# Altium schematic sheet Copy of testboard_chip1_bk.SchDoc
size E
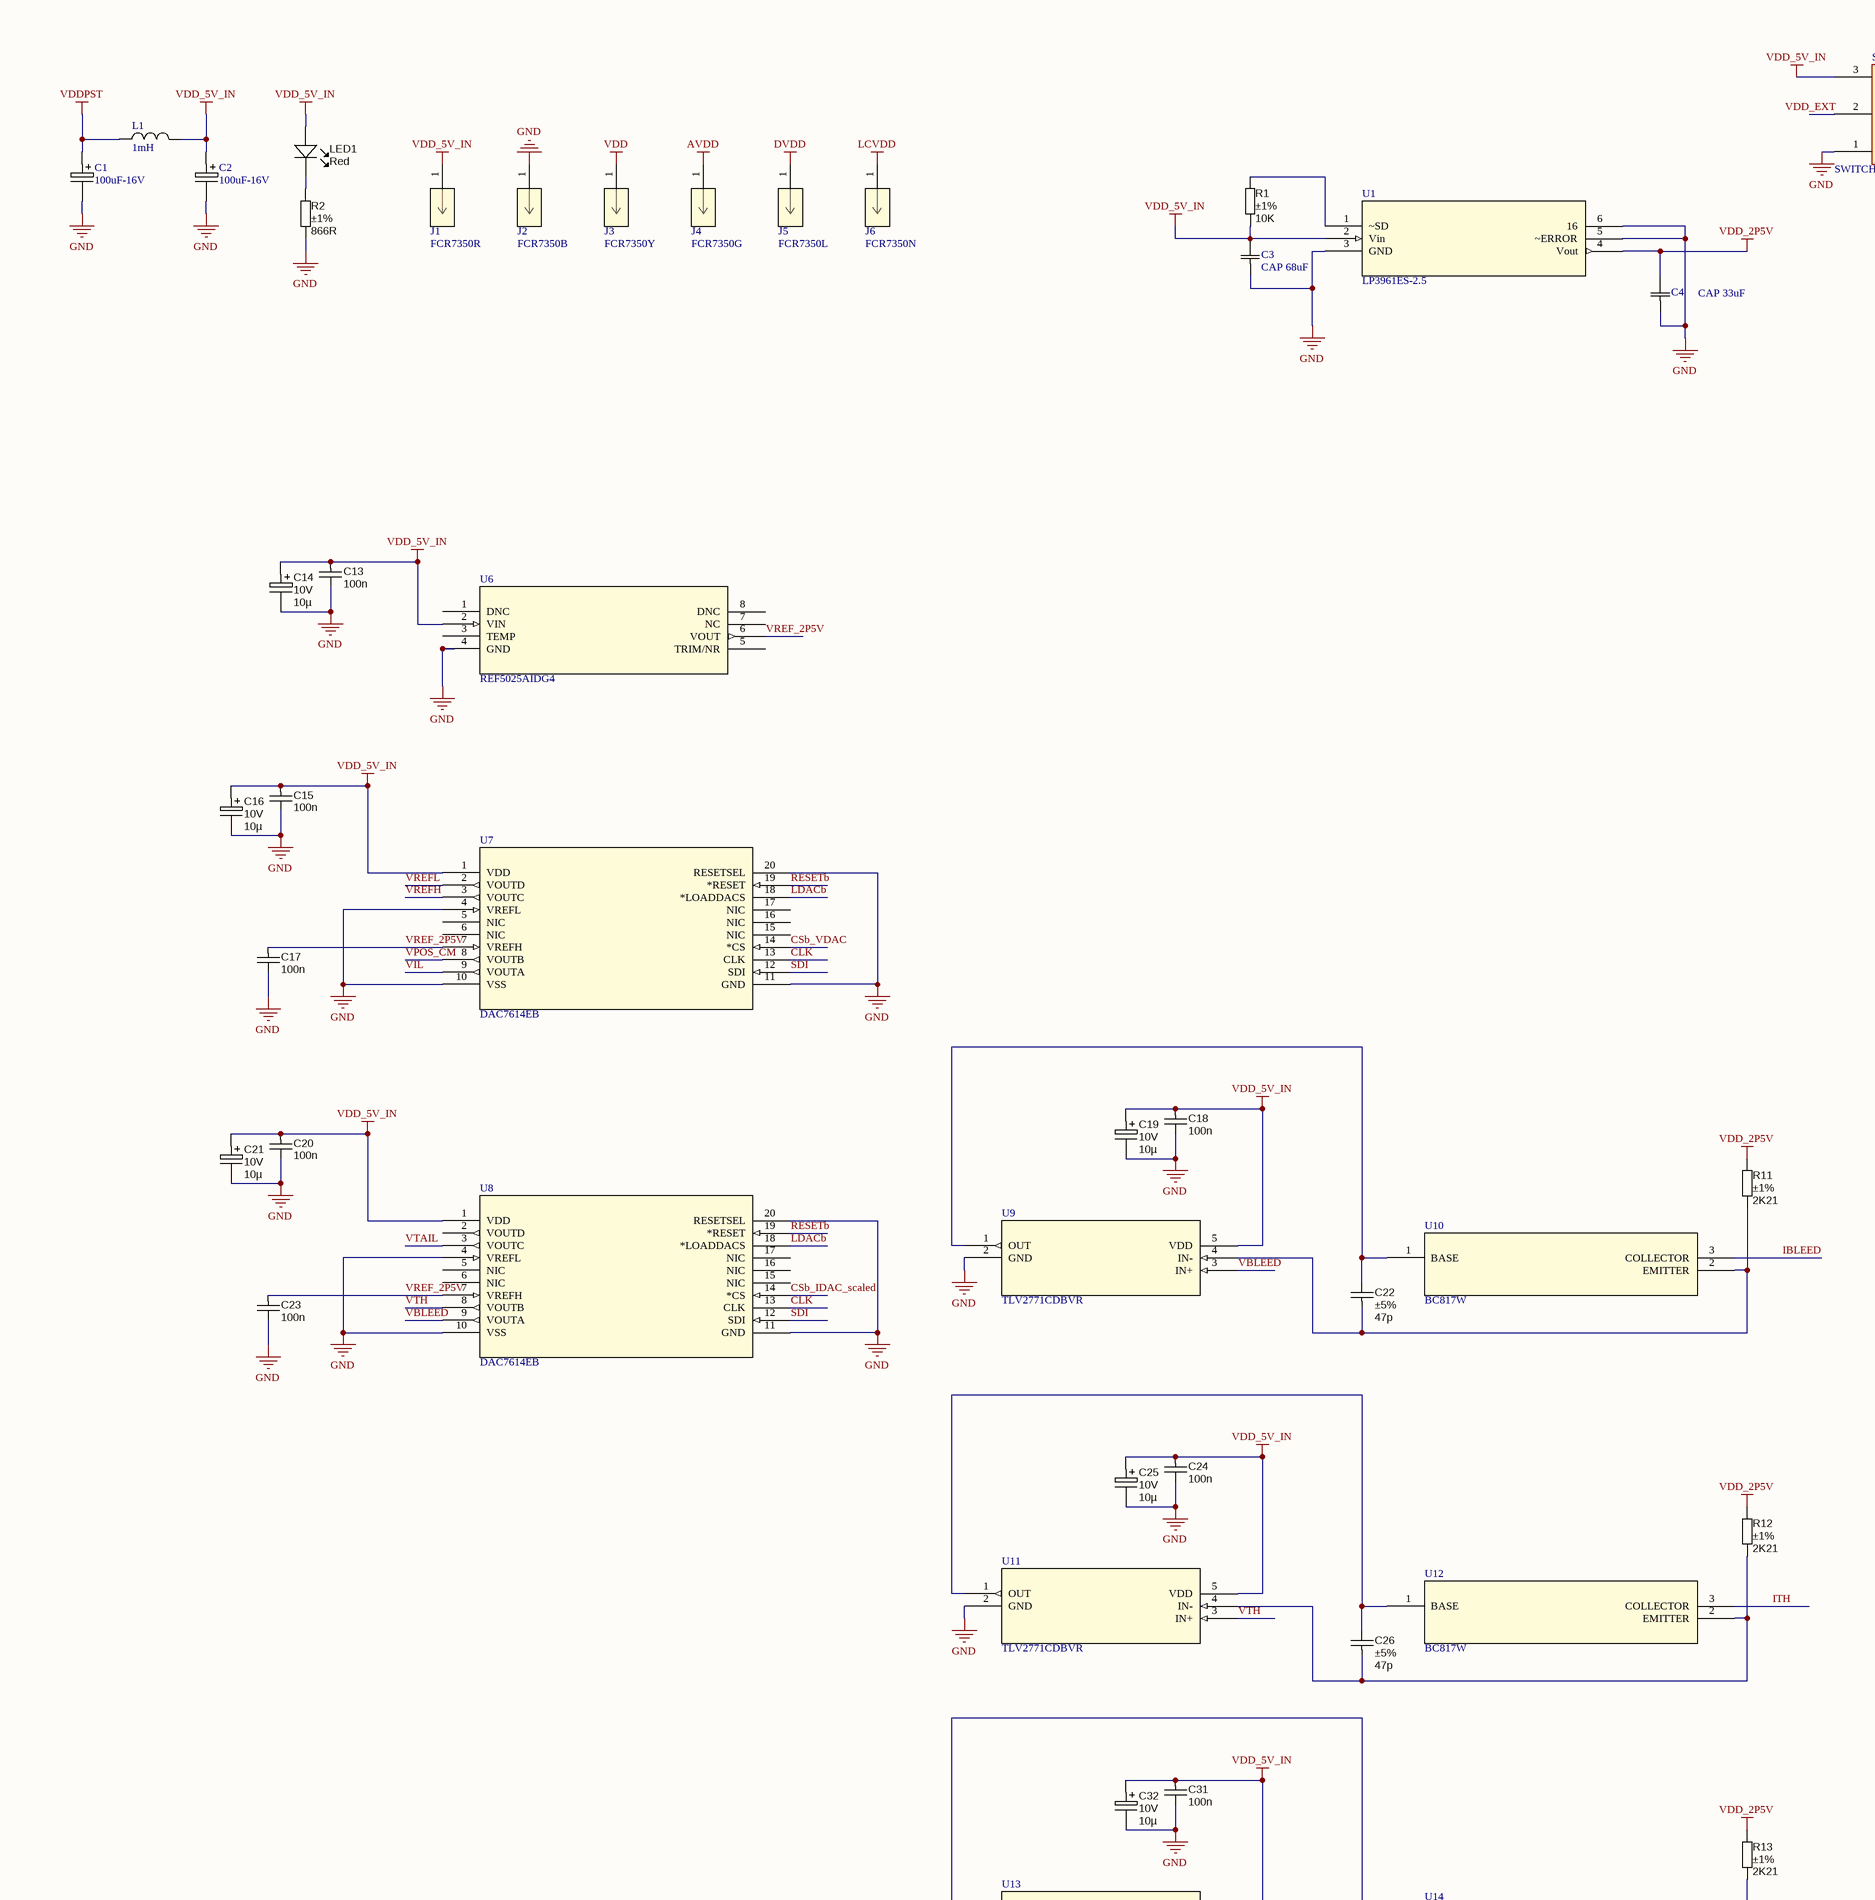
[diagram p0: Copy of testboard_chip1_bk.SchDoc, top left]
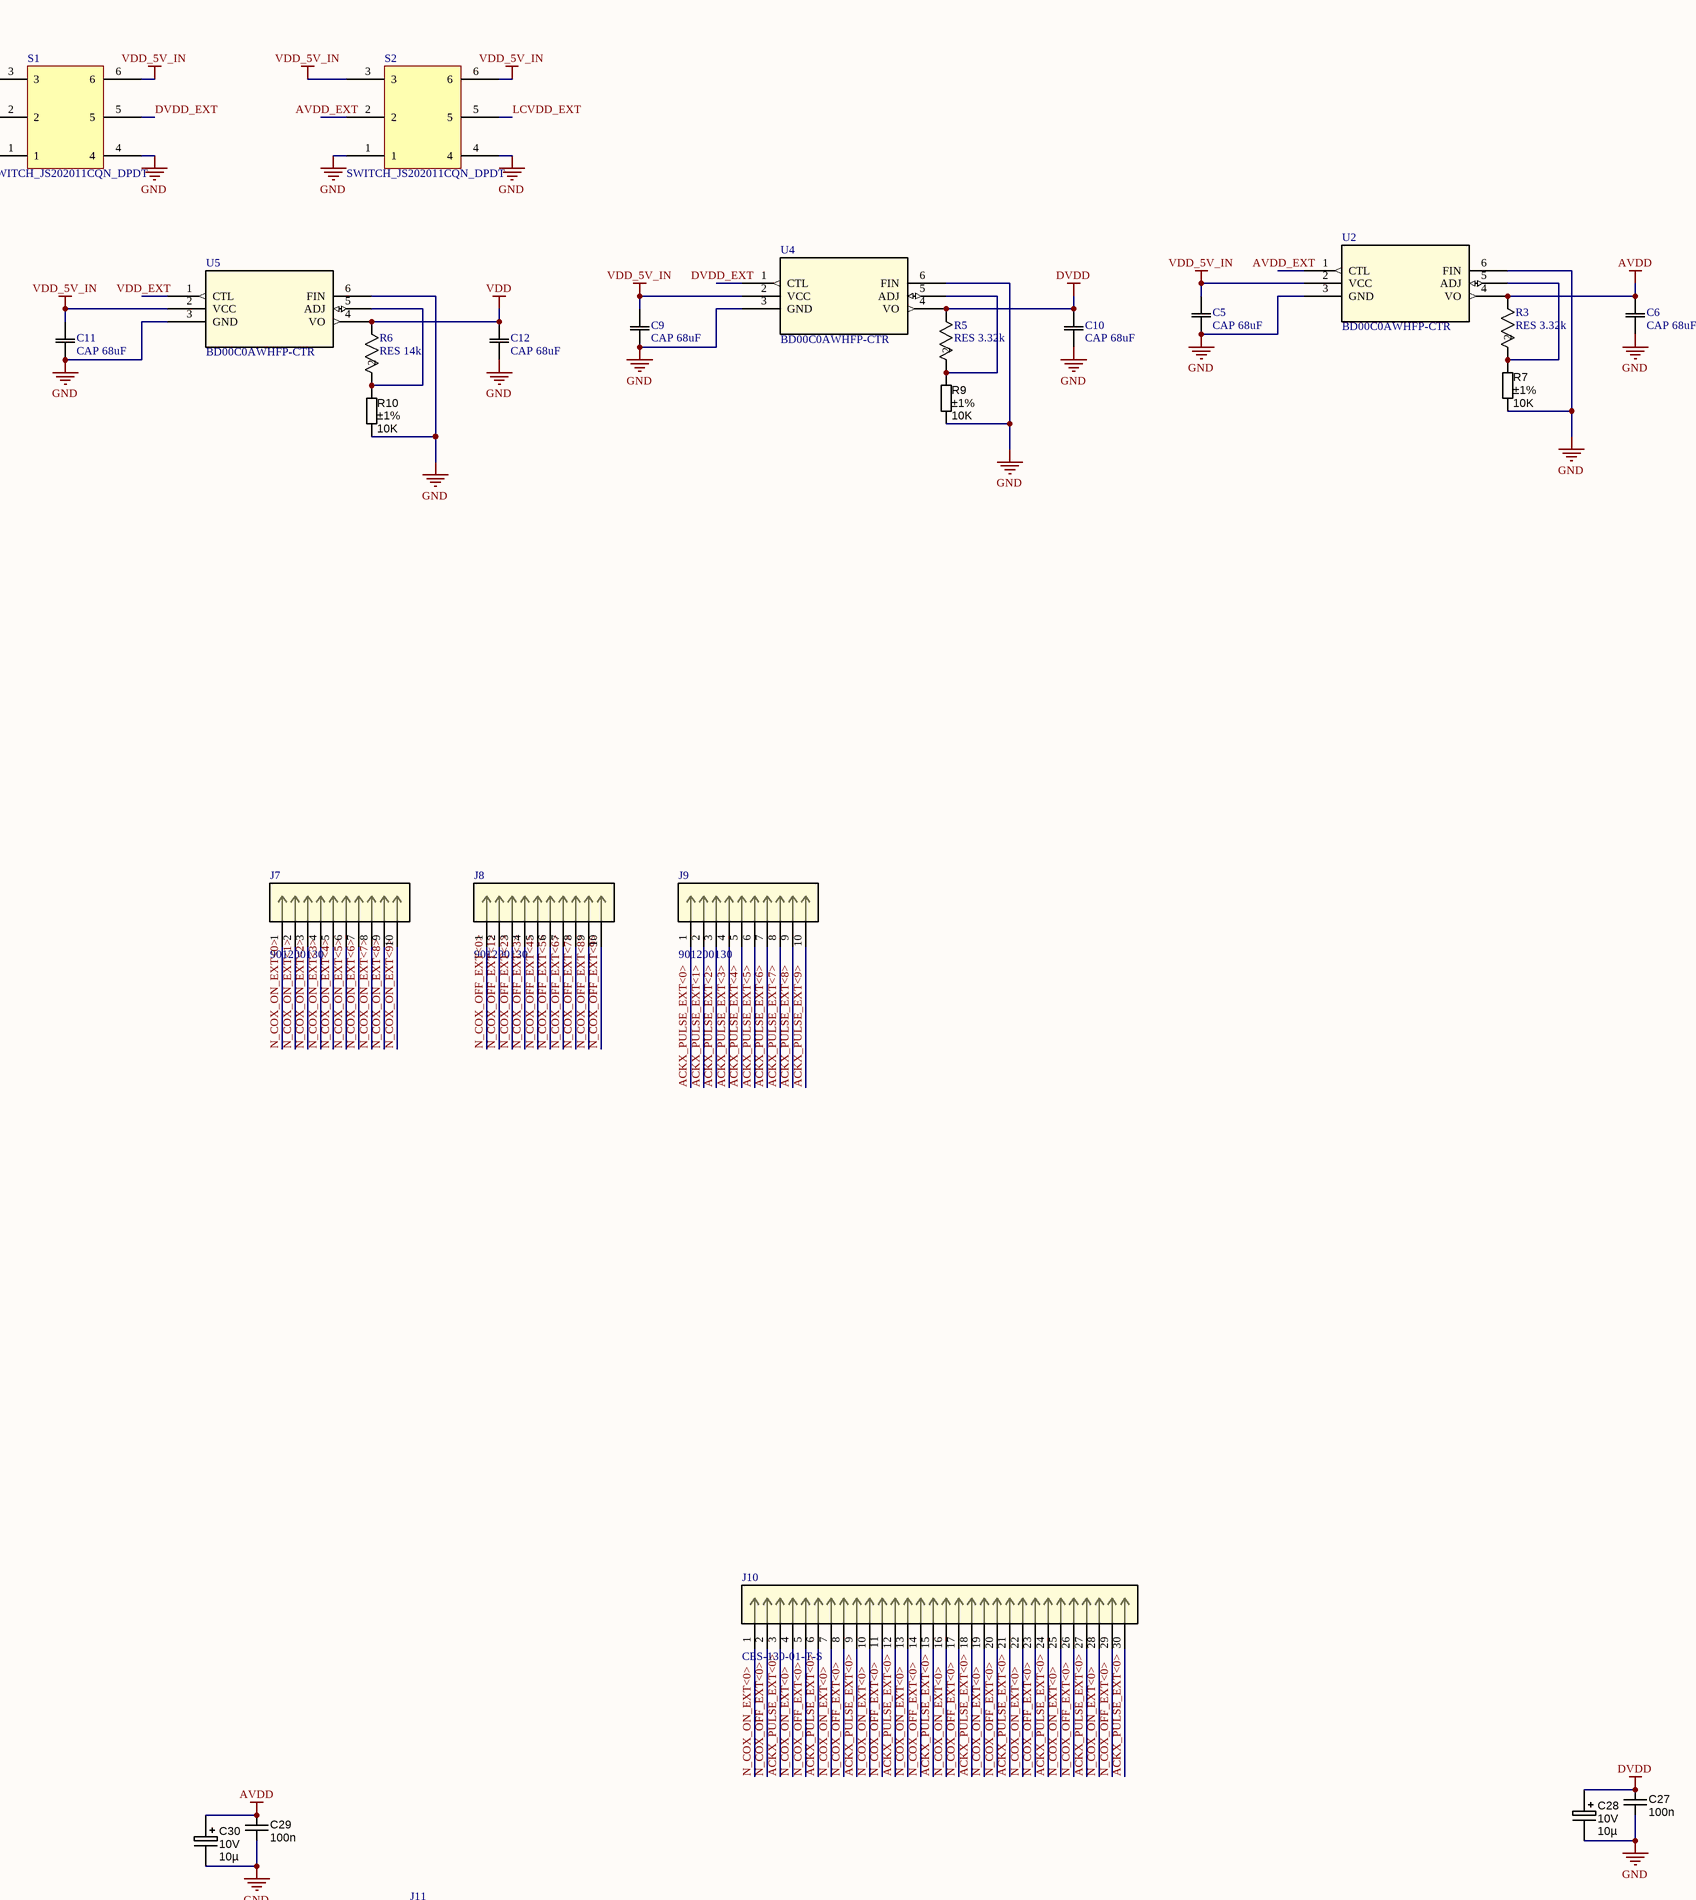
[diagram p1: Copy of testboard_chip1_bk.SchDoc, top middle]
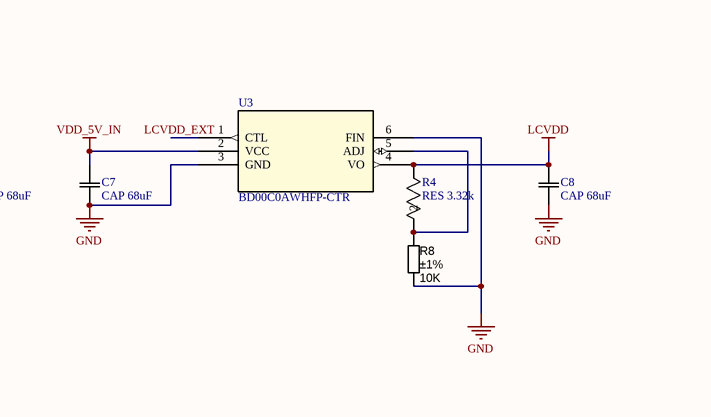
[diagram p2: Copy of testboard_chip1_bk.SchDoc, top right]
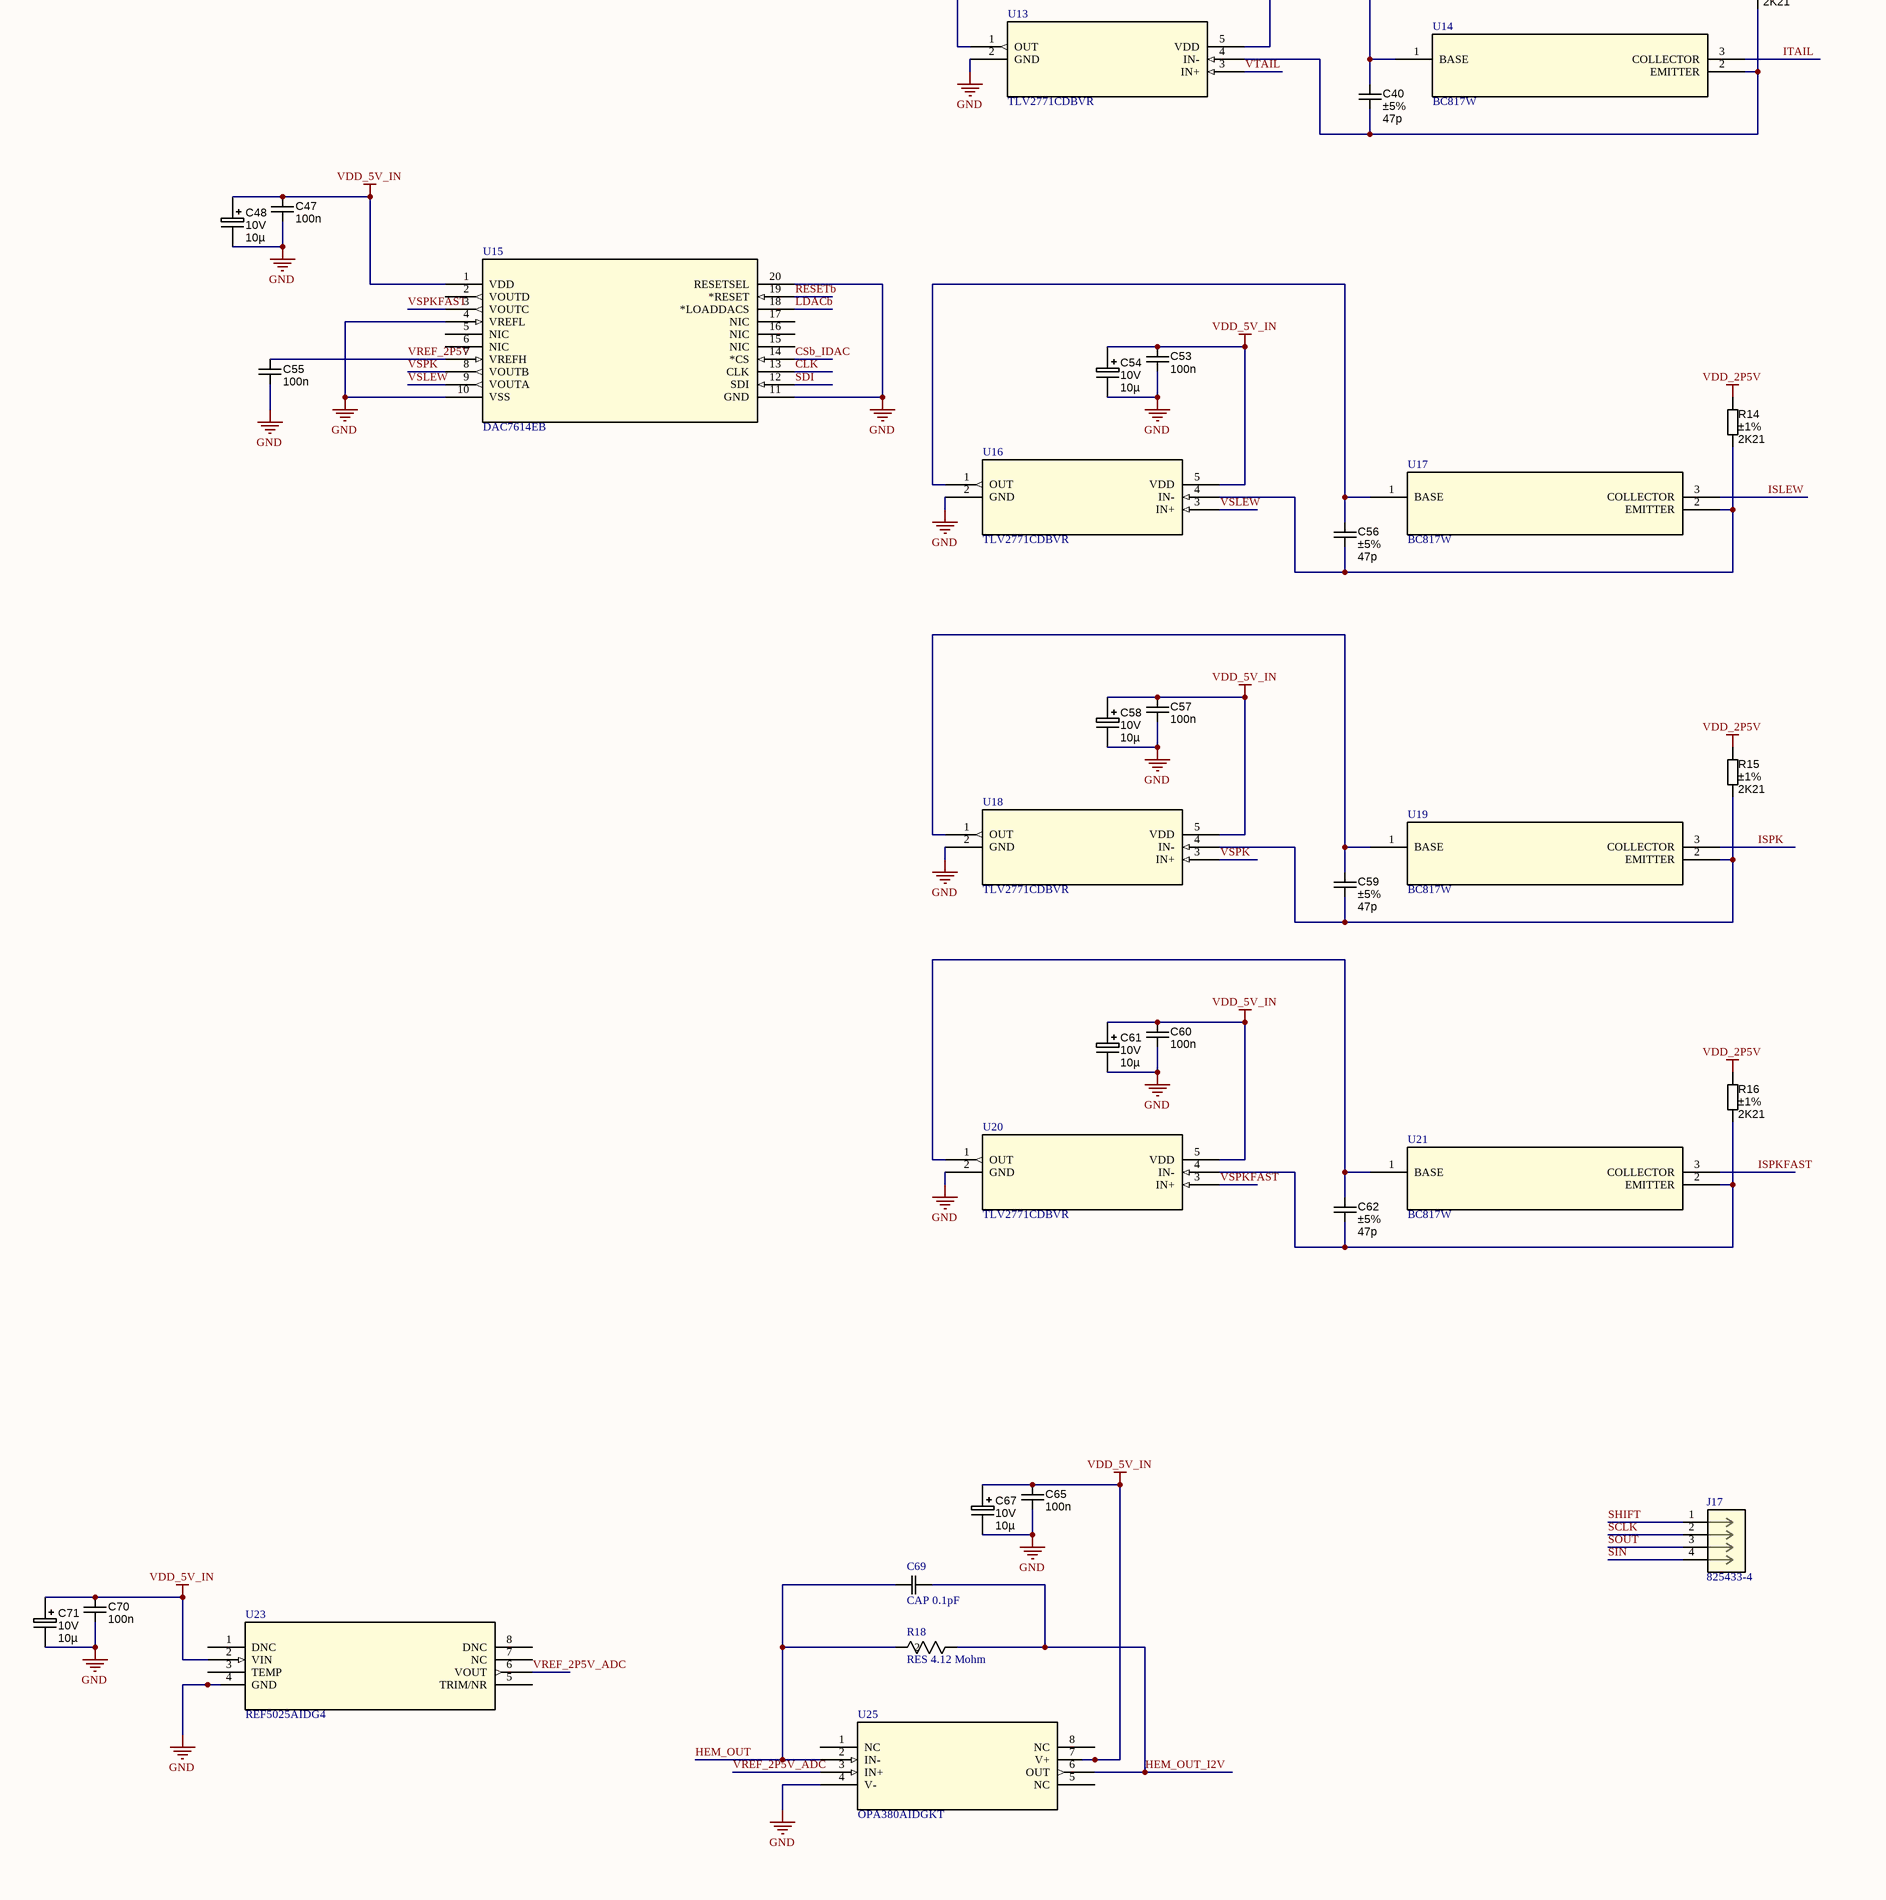
[diagram p3: Copy of testboard_chip1_bk.SchDoc, bottom left]
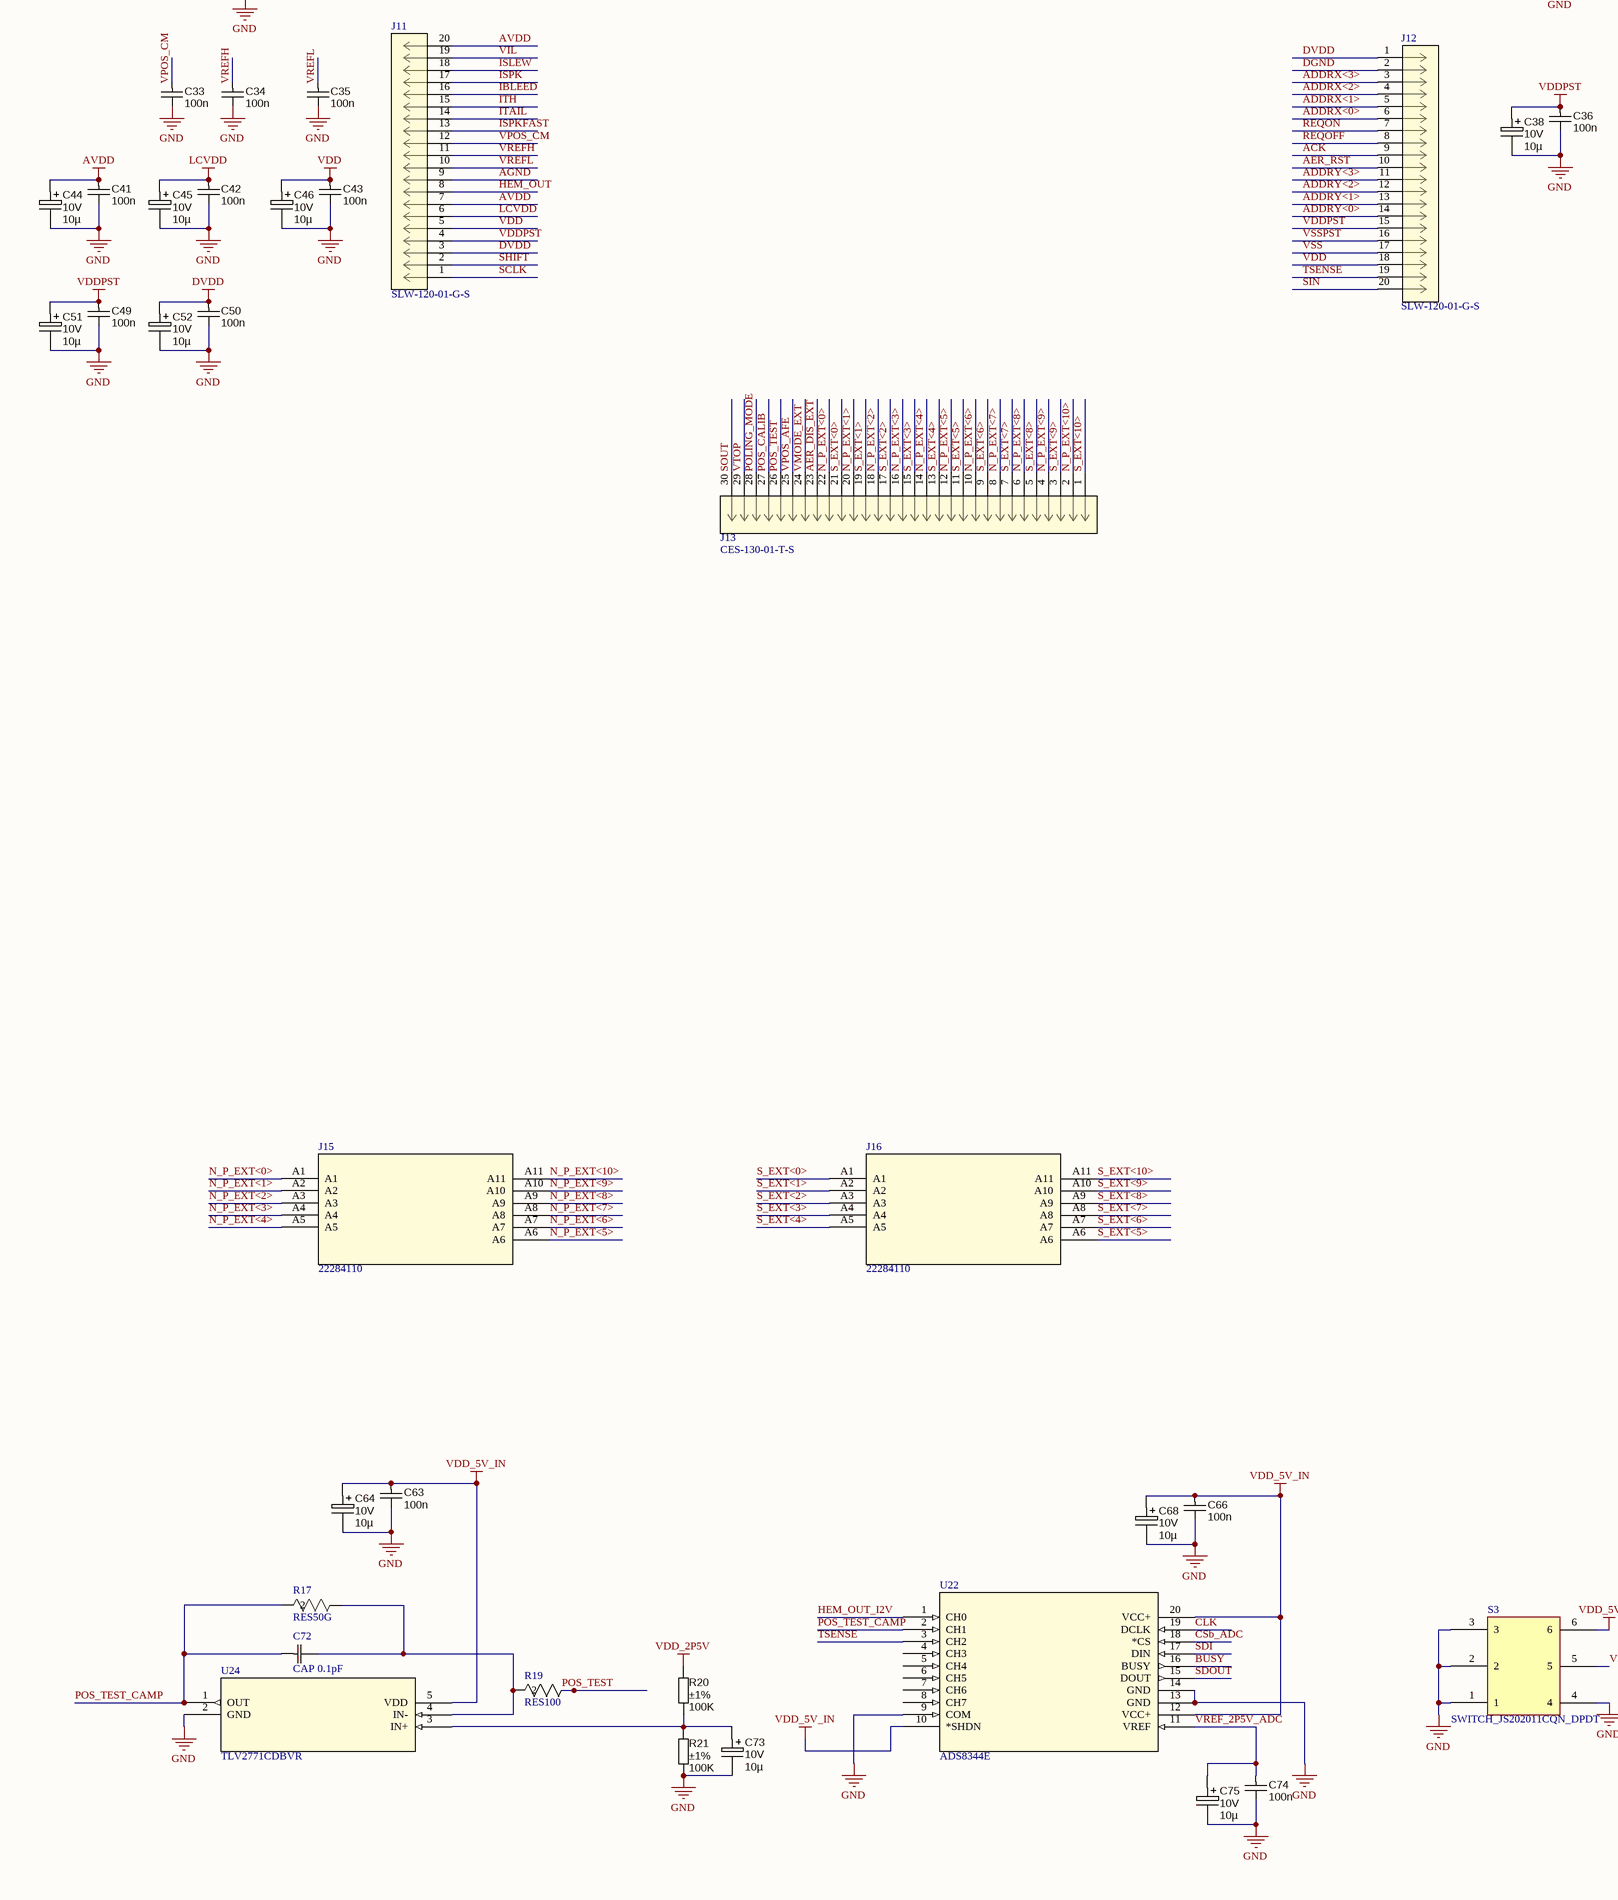
[diagram p4: Copy of testboard_chip1_bk.SchDoc, bottom middle]
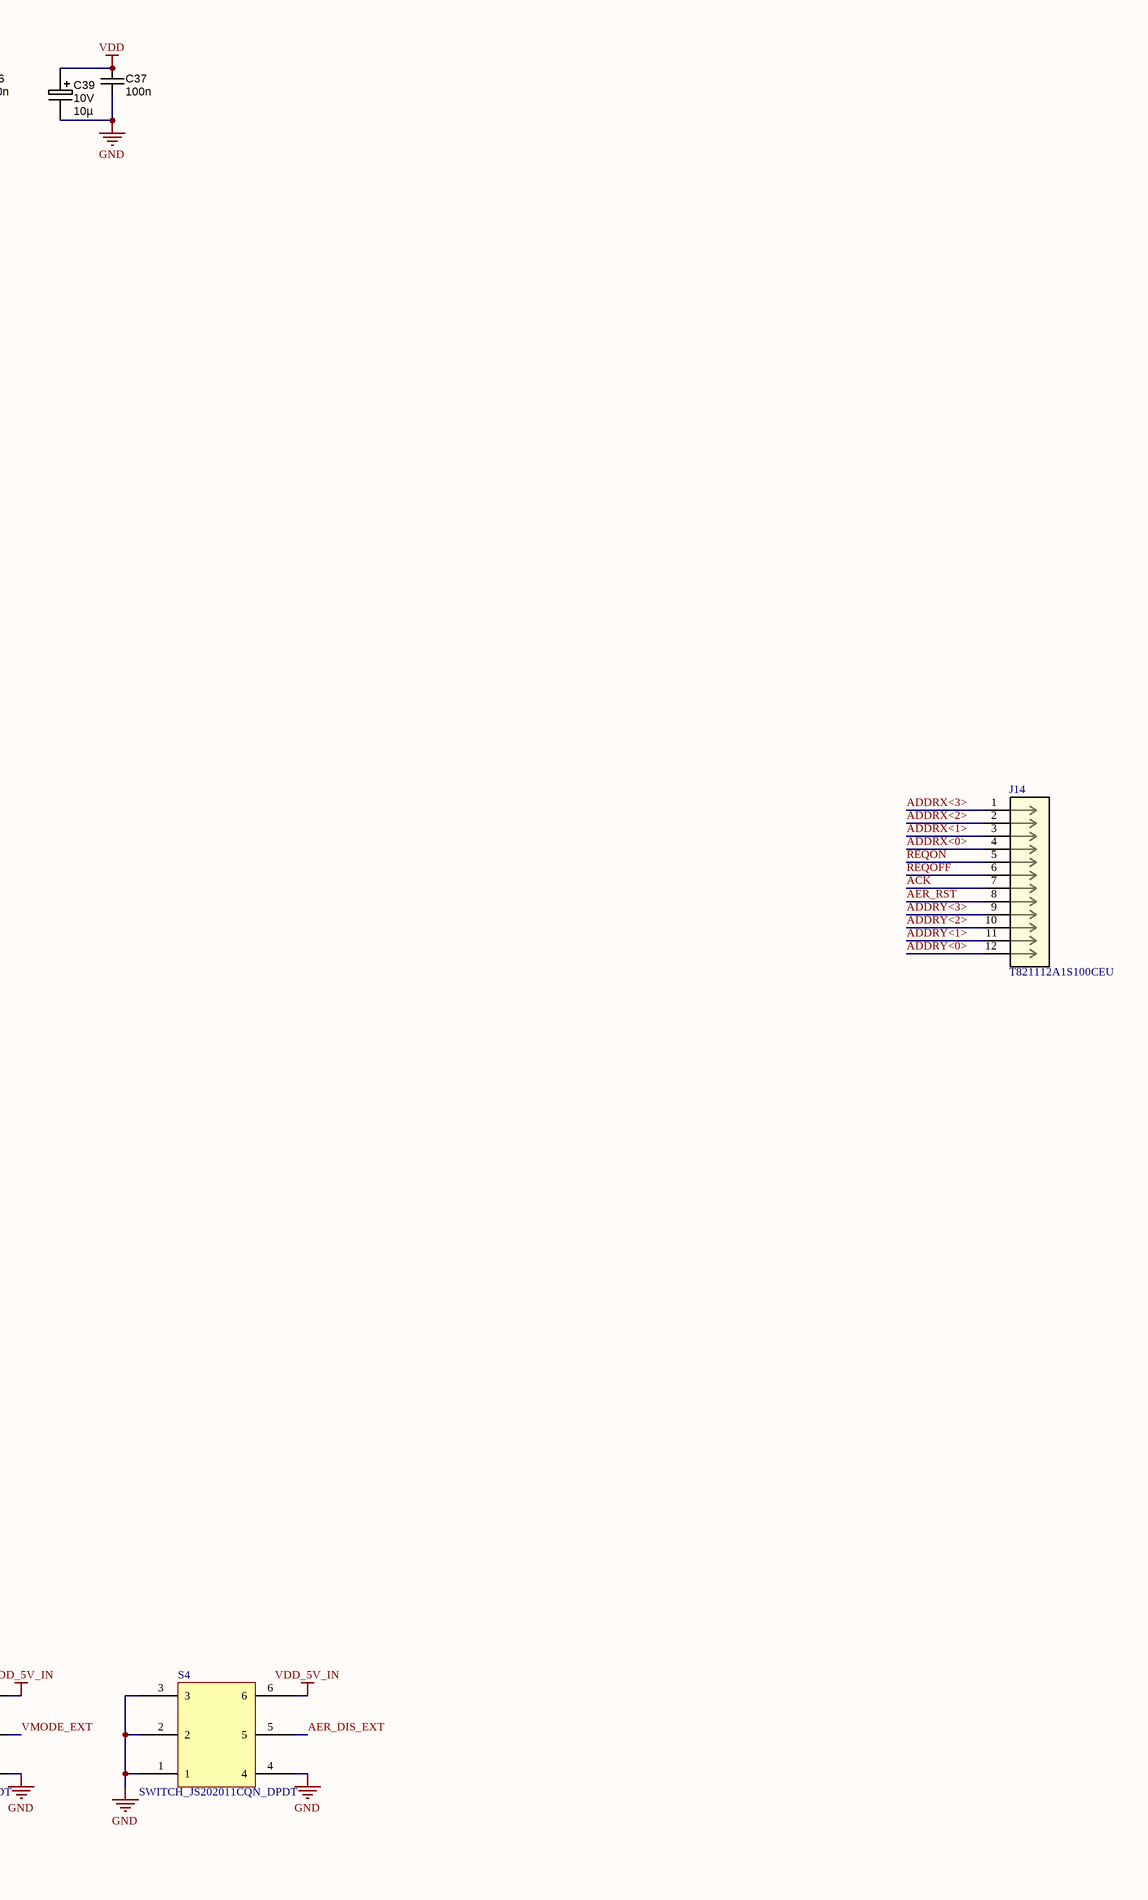
[diagram p5: Copy of testboard_chip1_bk.SchDoc, bottom right]

## Parts
C1  100uF-16V  [PANACAP-D-GENERIC]
C2  100uF-16V  [PANACAP-D-GENERIC]
C3  CAP 68uF  [CAP_3216_TDK]
C4  CAP 33uF  [CAP_4532_TDK]
C5  CAP 68uF  [CAP_3216_TDK]
C6  CAP 68uF  [CAP_3216_TDK]
C7  CAP 68uF  [CAP_3216_TDK]
C8  CAP 68uF  [CAP_3216_TDK]
C9  CAP 68uF  [CAP_3216_TDK]
C10  CAP 68uF  [CAP_3216_TDK]
C11  CAP 68uF  [CAP_3216_TDK]
C12  CAP 68uF  [CAP_3216_TDK]
C13  value 100n  [CAPC1608N]  (hidden comment: approved sub OK)
C14  Ratings: 10V  [CAPMP2012X150USR]  (hidden comment: 10µ)
C15  value 100n  [CAPC1608N]  (hidden comment: approved sub OK)
C16  Ratings: 10V  [CAPMP2012X150USR]  (hidden comment: 10µ)
C17  value 100n  [CAPC1608N]  (hidden comment: approved sub OK)
C18  value 100n  [CAPC1608N]  (hidden comment: approved sub OK)
C19  Ratings: 10V  [CAPMP2012X150USR]  (hidden comment: 10µ)
C20  value 100n  [CAPC1608N]  (hidden comment: approved sub OK)
C21  Ratings: 10V  [CAPMP2012X150USR]  (hidden comment: 10µ)
C22  Tolerance: ±5%  [CAPC1608N]  (hidden comment: 47p)
C23  value 100n  [CAPC1608N]  (hidden comment: approved sub OK)
C24  value 100n  [CAPC1608N]  (hidden comment: approved sub OK)
C25  Ratings: 10V  [CAPMP2012X150USR]  (hidden comment: 10µ)
C26  Tolerance: ±5%  [CAPC1608N]  (hidden comment: 47p)
C27  value 100n  [CAPC1608N]  (hidden comment: approved sub OK)
C28  Ratings: 10V  [CAPMP2012X150USR]  (hidden comment: 10µ)
C29  value 100n  [CAPC1608N]  (hidden comment: approved sub OK)
C30  Ratings: 10V  [CAPMP2012X150USR]  (hidden comment: 10µ)
C31  value 100n  [CAPC1608N]  (hidden comment: approved sub OK)
C32  Ratings: 10V  [CAPMP2012X150USR]  (hidden comment: 10µ)
C33  value 100n  [CAPC1608N]  (hidden comment: approved sub OK)
C34  value 100n  [CAPC1608N]  (hidden comment: approved sub OK)
C35  value 100n  [CAPC1608N]  (hidden comment: approved sub OK)
C36  value 100n  [CAPC1608N]  (hidden comment: approved sub OK)
C37  value 100n  [CAPC1608N]  (hidden comment: approved sub OK)
C38  Ratings: 10V  [CAPMP2012X150USR]  (hidden comment: 10µ)
C39  Ratings: 10V  [CAPMP2012X150USR]  (hidden comment: 10µ)
C40  Tolerance: ±5%  [CAPC1608N]  (hidden comment: 47p)
C41  value 100n  [CAPC1608N]  (hidden comment: approved sub OK)
C42  value 100n  [CAPC1608N]  (hidden comment: approved sub OK)
C43  value 100n  [CAPC1608N]  (hidden comment: approved sub OK)
C44  Ratings: 10V  [CAPMP2012X150USR]  (hidden comment: 10µ)
C45  Ratings: 10V  [CAPMP2012X150USR]  (hidden comment: 10µ)
C46  Ratings: 10V  [CAPMP2012X150USR]  (hidden comment: 10µ)
C47  value 100n  [CAPC1608N]  (hidden comment: approved sub OK)
C48  Ratings: 10V  [CAPMP2012X150USR]  (hidden comment: 10µ)
C49  value 100n  [CAPC1608N]  (hidden comment: approved sub OK)
C50  value 100n  [CAPC1608N]  (hidden comment: approved sub OK)
C51  Ratings: 10V  [CAPMP2012X150USR]  (hidden comment: 10µ)
C52  Ratings: 10V  [CAPMP2012X150USR]  (hidden comment: 10µ)
C53  value 100n  [CAPC1608N]  (hidden comment: approved sub OK)
C54  Ratings: 10V  [CAPMP2012X150USR]  (hidden comment: 10µ)
C55  value 100n  [CAPC1608N]  (hidden comment: approved sub OK)
C56  Tolerance: ±5%  [CAPC1608N]  (hidden comment: 47p)
C57  value 100n  [CAPC1608N]  (hidden comment: approved sub OK)
C58  Ratings: 10V  [CAPMP2012X150USR]  (hidden comment: 10µ)
C59  Tolerance: ±5%  [CAPC1608N]  (hidden comment: 47p)
C60  value 100n  [CAPC1608N]  (hidden comment: approved sub OK)
C61  Ratings: 10V  [CAPMP2012X150USR]  (hidden comment: 10µ)
C62  Tolerance: ±5%  [CAPC1608N]  (hidden comment: 47p)
C63  value 100n  [CAPC1608N]  (hidden comment: approved sub OK)
C64  Ratings: 10V  [CAPMP2012X150USR]  (hidden comment: 10µ)
C65  value 100n  [CAPC1608N]  (hidden comment: approved sub OK)
C66  value 100n  [CAPC1608N]  (hidden comment: approved sub OK)
C67  Ratings: 10V  [CAPMP2012X150USR]  (hidden comment: 10µ)
C68  Ratings: 10V  [CAPMP2012X150USR]  (hidden comment: 10µ)
C69  CAP 0.1pF  [CAP_0603_AVX]
C70  value 100n  [CAPC1608N]  (hidden comment: approved sub OK)
C71  Ratings: 10V  [CAPMP2012X150USR]  (hidden comment: 10µ)
C72  CAP 0.1pF  [CAP_0603_AVX]
C73  Ratings: 10V  [CAPMP2012X150USR]  (hidden comment: 10µ)
C74  value 100n  [CAPC1608N]  (hidden comment: approved sub OK)
C75  Ratings: 10V  [CAPMP2012X150USR]  (hidden comment: 10µ)
J1  FCR7350R  [CONN1_FCR7350R_CLF]
J2  FCR7350B  [CONN1_FCR7350R_CLF]
J3  FCR7350Y  [CONN1_FCR7350R_CLF]
J4  FCR7350G  [CONN_FCR7350G_CLF]
J5  FCR7350L  [CONN1_FCR7350R_CLF]
J6  FCR7350N  [CONN1_FCR7350R_CLF]
J7  901200130  [CON_901200130_MOL]
J8  901200130  [CON_901200130_MOL]
J9  901200130  [CON_901200130_MOL]
J10  CES-130-01-T-S  [CON30_1X30_TU_SLW_SAI]
J11  SLW-120-01-G-S  [CON20_1X20_TU_SLW_SAI]
J12  SLW-120-01-G-S  [CON20_1X20_TU_SLW_SAI]
J13  CES-130-01-T-S  [CON30_1X30_TU_SLW_SAI]
J14  T821112A1S100CEU  [CONN_T821112A1S100CEU_AMP]
J15  22284110  [22-28-4110_MOL]
J16  22284110  [22-28-4110_MOL]
J17  825433-4  [CON4_1X4_P100UM_HDR2_TYC]
L1  1mH  [MCSDRB7032-102MHF]
LED1  Red  [LED-0603-RED]
R1  value 10K  Tolerance: ±1%  [RESC1608N]  (hidden comment: Thick Film)
R2  value 866R  Tolerance: ±1%  [RESC1608N]  (hidden comment: Thick Film)
R3  RES 3.32k  [RC0603N_YAG]
R4  RES 3.32k  [RC0603N_YAG]
R5  RES 3.32k  [RC0603N_YAG]
R6  RES 14k  [RC0603N_YAG]
R7  value 10K  Tolerance: ±1%  [RESC1608N]  (hidden comment: Thick Film)
R8  value 10K  Tolerance: ±1%  [RESC1608N]  (hidden comment: Thick Film)
R9  value 10K  Tolerance: ±1%  [RESC1608N]  (hidden comment: Thick Film)
R10  value 10K  Tolerance: ±1%  [RESC1608N]  (hidden comment: Thick Film)
R11  value 2K21  Tolerance: ±1%  [RESC1608N]  (hidden comment: Thick Film)
R12  value 2K21  Tolerance: ±1%  [RESC1608N]  (hidden comment: Thick Film)
R13  value 2K21  Tolerance: ±1%  [RESC1608N]  (hidden comment: Thick Film)
R14  value 2K21  Tolerance: ±1%  [RESC1608N]  (hidden comment: Thick Film)
R15  value 2K21  Tolerance: ±1%  [RESC1608N]  (hidden comment: Thick Film)
R16  value 2K21  Tolerance: ±1%  [RESC1608N]  (hidden comment: Thick Film)
R17  RES50G  [RES_RH732A_TYC]
R18  RES 4.12 Mohm  [RC0805N_VIS]
R19  RES100  [RC0603N_YAG]
R20  value 100K  Tolerance: ±1%  [RESC1608N]  (hidden comment: Thick Film)
R21  value 100K  Tolerance: ±1%  [RESC1608N]  (hidden comment: Thick Film)
S1  SWITCH_JS202011CQN_DPDT  [PCBComponent_1]
S2  SWITCH_JS202011CQN_DPDT  [PCBComponent_1]
S3  SWITCH_JS202011CQN_DPDT  [PCBComponent_1]
S4  SWITCH_JS202011CQN_DPDT  [PCBComponent_1]
U1  LP3961ES-2.5  [TS5B_TEX]
U2  BD00C0AWHFP-CTR  [HRP5_BD00C0_ROM]
U3  BD00C0AWHFP-CTR  [HRP5_BD00C0_ROM]
U4  BD00C0AWHFP-CTR  [HRP5_BD00C0_ROM]
U5  BD00C0AWHFP-CTR  [HRP5_BD00C0_ROM]
U6  REF5025AIDG4  [D8]
U7  DAC7614EB  [DB20]
U8  DAC7614EB  [DB20]
U9  TLV2771CDBVR  [DBV5]
U10  BC817W  [SOT323_NEX]
U11  TLV2771CDBVR  [DBV5]
U12  BC817W  [SOT323_NEX]
U13  TLV2771CDBVR  [DBV5]
U14  BC817W  [SOT323_NEX]
U15  DAC7614EB  [DB20]
U16  TLV2771CDBVR  [DBV5]
U17  BC817W  [SOT323_NEX]
U18  TLV2771CDBVR  [DBV5]
U19  BC817W  [SOT323_NEX]
U20  TLV2771CDBVR  [DBV5]
U21  BC817W  [SOT323_NEX]
U22  ADS8344E  [DBQ20]
U23  REF5025AIDG4  [D8]
U24  TLV2771CDBVR  [DBV5]
U25  OPA380AIDGKT  [DGK8]

## Nets
AVDD: C6.2 C29.1 C30.1 C41.1 C44.1 J4.1 J11.7 J11.20 R3.1 U2.4(VO)
DVDD: C10.2 C27.1 C28.1 C50.1 C52.1 J5.1 J11.3 J12.1 R5.1 U4.4(VO)
GND: C1.- C2.- C3.1 C4.1 C5.1 C6.1 C7.1 C8.1 C9.1 C10.1 C11.1 C12.1 C13.2 C14.2 C15.2 C16.2 C17.2 C18.2 C19.2 C20.2 C21.2 C23.2 C24.2 C25.2 C27.2 C28.2 C29.2 C30.2 C31.2 C32.2 C33.2 C34.2 C35.2 C36.2 C37.2 C38.2 C39.2 C41.2 C42.2 C43.2 C44.2 C45.2 C46.2 C47.2 C48.2 C49.2 C50.2 C51.2 C52.2 C53.2 C54.2 C55.2 C57.2 C58.2 C60.2 C61.2 C63.2 C64.2 C65.2 C66.2 C67.2 C68.2 C70.2 C71.2 C73.2 C74.2 C75.2 J2.1 R2.2 R7.2 R8.2 R9.2 R10.2 R21.2 S1.1 S1.4 S2.1 S2.4 S3.1 S3.2 S3.3 S3.4 S4.1 S4.2 S4.3 S4.4 U1.3(GND) U1.5(~ERROR) U1.6(16) U2.3(GND) U2.6(FIN) U3.3(GND) U3.6(FIN) U4.3(GND) U4.6(FIN) U5.3(GND) U5.6(FIN) U6.4(GND) U7.4(VREFL) U7.10(VSS) U7.11(GND) U7.20(RESETSEL) U8.4(VREFL) U8.10(VSS) U8.11(GND) U8.20(RESETSEL) U9.2(GND) U11.2(GND) U13.2(GND) U15.4(VREFL) U15.10(VSS) U15.11(GND) U15.20(RESETSEL) U16.2(GND) U18.2(GND) U20.2(GND) U22.9(COM) U22.13(GND) U22.14(GND) U23.4(GND) U24.2(GND) U25.4(V-)
LCVDD: C8.2 C42.1 C45.1 J6.1 J11.6 R4.1 U3.4(VO)
VDD: C12.2 C37.1 C39.1 C43.1 C46.1 J3.1 J11.5 J12.18 R6.1 U5.4(VO)
VDD_2P5V: C4.2 R11.1 R12.1 R13.1 R14.1 R15.1 R16.1 R20.1 U1.4(Vout)
VDD_5V_IN: C2.+ C3.2 C5.2 C7.2 C9.2 C11.2 C13.1 C14.1 C15.1 C16.1 C18.1 C19.1 C20.1 C21.1 C24.1 C25.1 C31.1 C32.1 C47.1 C48.1 C53.1 C54.1 C57.1 C58.1 C60.1 C61.1 C63.1 C64.1 C65.1 C66.1 C67.1 C68.1 C70.1 C71.1 J1.1 L1.2 LED1.A R1.2 S1.3 S1.6 S2.3 S2.6 S3.6 S4.6 U1.2(Vin) U2.2(VCC) U3.2(VCC) U4.2(VCC) U5.2(VCC) U6.2(VIN) U7.1(VDD) U8.1(VDD) U9.5(VDD) U11.5(VDD) U13.5(VDD) U15.1(VDD) U16.5(VDD) U18.5(VDD) U20.5(VDD) U22.10(*SHDN) U22.12(VCC+) U22.20(VCC+) U23.2(VIN) U24.5(VDD) U25.7(V+)
VDDPST: C1.+ C36.1 C38.1 C49.1 C51.1 J11.4 J12.15 L1.1
ACK: J12.9 J14.7
ACKX_PULSE_EXT<0>: J9.1 J10.3 J10.6 J10.9 J10.12 J10.15 J10.18 J10.21 J10.24 J10.27 J10.30
ACKX_PULSE_EXT<1>: J9.2
ACKX_PULSE_EXT<2>: J9.3
ACKX_PULSE_EXT<3>: J9.4
ACKX_PULSE_EXT<4>: J9.5
ACKX_PULSE_EXT<5>: J9.6
ACKX_PULSE_EXT<6>: J9.7
ACKX_PULSE_EXT<7>: J9.8
ACKX_PULSE_EXT<8>: J9.9
ACKX_PULSE_EXT<9>: J9.10
ADDRX<0>: J12.6 J14.4
ADDRX<1>: J12.5 J14.3
ADDRX<2>: J12.4 J14.2
ADDRX<3>: J12.3 J14.1
ADDRY<0>: J12.14 J14.12
ADDRY<1>: J12.13 J14.11
ADDRY<2>: J12.12 J14.10
ADDRY<3>: J12.11 J14.9
AER_DIS_EXT: J13.23 S4.5
AER_RST: J12.10 J14.8
AGND: J11.9
BUSY: U22.16(BUSY)
CLK: U7.13(CLK) U8.13(CLK) U15.13(CLK) U22.19(DCLK)
CSb_ADC: U22.18(*CS)
CSb_IDAC: U15.14(*CS)
CSb_IDAC_scaled: U8.14(*CS)
CSb_VDAC: U7.14(*CS)
DGND: J12.2
DVDD_EXT: S1.5
HEM_OUT: C69.1 J11.8 R18.2 U25.2(IN-)
HEM_OUT_I2V: C69.2 R18.1 U22.1(CH0) U25.6(OUT)
IBLEED: J11.16 U10.3(COLLECTOR)
ISLEW: J11.18 U17.3(COLLECTOR)
ISPK: J11.17 U19.3(COLLECTOR)
ISPKFAST: J11.13 U21.3(COLLECTOR)
ITAIL: J11.14 U14.3(COLLECTOR)
ITH: J11.15 U12.3(COLLECTOR)
LCVDD_EXT: S2.5
LDACb: U7.18(*LOADDACS) U8.18(*LOADDACS) U15.18(*LOADDACS)
N_COX_OFF_EXT<0>: J8.1 J10.2 J10.5 J10.8 J10.11 J10.14 J10.17 J10.20 J10.23 J10.26 J10.29
N_COX_OFF_EXT<1>: J8.2
N_COX_OFF_EXT<2>: J8.3
N_COX_OFF_EXT<3>: J8.4
N_COX_OFF_EXT<4>: J8.5
N_COX_OFF_EXT<5>: J8.6
N_COX_OFF_EXT<6>: J8.7
N_COX_OFF_EXT<7>: J8.8
N_COX_OFF_EXT<8>: J8.9
N_COX_OFF_EXT<9>: J8.10
N_COX_ON_EXT<0>: J7.1 J10.1 J10.4 J10.7 J10.10 J10.13 J10.16 J10.19 J10.22 J10.25 J10.28
N_COX_ON_EXT<1>: J7.2
N_COX_ON_EXT<2>: J7.3
N_COX_ON_EXT<3>: J7.4
N_COX_ON_EXT<4>: J7.5
N_COX_ON_EXT<5>: J7.6
N_COX_ON_EXT<6>: J7.7
N_COX_ON_EXT<7>: J7.8
N_COX_ON_EXT<8>: J7.9
N_COX_ON_EXT<9>: J7.10
N_P_EXT<0>: J13.22 J15.A1
N_P_EXT<1>: J13.20 J15.A2
N_P_EXT<2>: J13.18 J15.A3
N_P_EXT<3>: J13.16 J15.A4
N_P_EXT<4>: J13.14 J15.A5
N_P_EXT<5>: J13.12 J15.A6
N_P_EXT<6>: J13.10 J15.A7
N_P_EXT<7>: J13.8 J15.A8
N_P_EXT<8>: J13.6 J15.A9
N_P_EXT<9>: J13.4 J15.A10
N_P_EXT<10>: J13.2 J15.A11
POLING_MODE: J13.28
POS_CALIB: J13.27
POS_TEST: J13.26 R19.1
POS_TEST_CAMP: C72.1 R17.2 U22.2(CH1) U24.1(OUT)
REQOFF: J12.8 J14.6
REQON: J12.7 J14.5
RESETb: U7.19(*RESET) U8.19(*RESET) U15.19(*RESET)
S_EXT<0>: J13.21 J16.A1
S_EXT<1>: J13.19 J16.A2
S_EXT<2>: J13.17 J16.A3
S_EXT<3>: J13.15 J16.A4
S_EXT<4>: J13.13 J16.A5
S_EXT<5>: J13.11 J16.A6
S_EXT<6>: J13.9 J16.A7
S_EXT<7>: J13.7 J16.A8
S_EXT<8>: J13.5 J16.A9
S_EXT<9>: J13.3 J16.A10
S_EXT<10>: J13.1 J16.A11
SCLK: J11.1 J17.2
SDI: U7.12(SDI) U8.12(SDI) U15.12(SDI) U22.17(DIN)
SDOUT: U22.15(DOUT)
SHIFT: J11.2 J17.1
SIN: J12.20 J17.4
SOUT: J13.30 J17.3
TSENSE: J12.19 U22.3(CH2)
VBLEED: U8.9(VOUTA) U9.3(IN+)
VIL: J11.19 U7.9(VOUTA)
VMODE_EXT: J13.24 S3.5
VPOS_AFE: J13.25
VPOS_CM: J11.12 U7.8(VOUTB)
VREF_2P5V: C17.1 C23.1 C55.1 U6.6(VOUT) U7.7(VREFH) U8.7(VREFH) U15.7(VREFH)
VREF_2P5V_ADC: C74.1 C75.1 U22.11(VREF) U23.6(VOUT) U25.3(IN+)
VREFH: J11.11 U7.3(VOUTC)
VREFL: J11.10 U7.2(VOUTD)
VSLEW: U15.9(VOUTA) U16.3(IN+)
VSPK: U15.8(VOUTB) U18.3(IN+)
VSPKFAST: U15.3(VOUTC) U20.3(IN+)
VSS: J12.17
VSSPST: J12.16
VTAIL: U8.3(VOUTC) U13.3(IN+)
VTH: U8.8(VOUTB) U11.3(IN+)
VTOP: J13.29
NetC22_1: C22.1 R11.2 U9.4(IN-) U10.2(EMITTER)
NetC22_2: C22.2 U9.1(OUT) U10.1(BASE)
NetC26_1: C26.1 R12.2 U11.4(IN-) U12.2(EMITTER)
NetC26_2: C26.2 U11.1(OUT) U12.1(BASE)
NetC40_1: C40.1 R13.2 U13.4(IN-) U14.2(EMITTER)
NetC40_2: C40.2 U13.1(OUT) U14.1(BASE)
NetC56_1: C56.1 R14.2 U16.4(IN-) U17.2(EMITTER)
NetC56_2: C56.2 U16.1(OUT) U17.1(BASE)
NetC59_1: C59.1 R15.2 U18.4(IN-) U19.2(EMITTER)
NetC59_2: C59.2 U18.1(OUT) U19.1(BASE)
NetC62_1: C62.1 R16.2 U20.4(IN-) U21.2(EMITTER)
NetC62_2: C62.2 U20.1(OUT) U21.1(BASE)
NetC72_2: C72.2 R17.1 R19.2 U24.4(IN-)
NetC73_1: C73.1 R20.2 R21.1 U24.3(IN+)
NetLED1_K: LED1.K R2.1
NetR1_1: R1.1 U1.1(~SD)
NetR3_2: R3.2 R7.1 U2.5(ADJ)
NetR4_2: R4.2 R8.1 U3.5(ADJ)
NetR5_2: R5.2 R9.1 U4.5(ADJ)
NetR6_2: R6.2 R10.1 U5.5(ADJ)

Not connected (* = marked no-connect by the designer): C33 1; C34 1; C35 1; S1 2; S2 2; U2 1(CTL); U3 1(CTL); U4 1(CTL); U5 1(CTL); U6 1(DNC) 3(TEMP) 5(TRIM/NR) 7(NC) 8(DNC); U7 5(NIC) 6(NIC) 15(NIC) 16(NIC) 17(NIC); U8 2(VOUTD) 5(NIC) 6(NIC) 15(NIC) 16(NIC) 17(NIC); U15 2(VOUTD) 5(NIC) 6(NIC) 15(NIC) 16(NIC) 17(NIC); U22 4(CH3) 5(CH4) 6(CH5) 7(CH6) 8(CH7); U23 1(DNC) 3(TEMP) 5(TRIM/NR) 7(NC) 8(DNC); U25 1(NC) 5(NC) 8(NC)

## Notes on the sheet
- Labels drawn without touching a wire or pin: AVDD_EXT, DVDD_EXT, LCVDD_EXT, VDD_EXT, VPOS_CM, VREFH, VREFL

## Library data of the parts
C1 C2 = PANACAP-100UF-16V-FK: GENERIC CAPACITOR POLARISED; Supplier 1: Digi-Key; Supplier Part Number 1: PCE3783TR-ND
C3 C5-C12 = C3216X5R1A686M160AC: No Description Available; Mfr_Name: TDK; Type: DEV; Copyright: Copyright (C) 2022 Ultra Librarian. All rights reserved.; Manufacturer_Part_Number: C3216X5R1A686M160AC; RefDes: RefDes
C4 = C4532X7R1C336M250KC: No Description Available; Mfr_Name: TDK; Type: DEV; Copyright: Copyright (C) 2022 Ultra Librarian. All rights reserved.; Manufacturer_Part_Number: C4532X7R1C336M250KC; RefDes: RefDes
C13 C15 C17 C18 C20 C23 C24 C27 C29 C31 C33-C37 C41-C43 C47 C49 C50 C53 C55 C57 C60 C63 C65 C66 C70 C74 = CAPC_100n_0603: Capacitor SMD Cer 100nF 10% 50V X7R 0603; Manufacturer 1: AVX Corporation; Manufacturer Part Number 1: 06035C104KAT2A; Ratings: 50V; X7R; Material: ceramic; Manufacturer 2: TDK Corporation; Manufacturer Part Number 2: C1608X7R1H104K; Package / Case: 0603 (1608 Metric); Tolerance: ±10%; Supplier 1: Digi-Key; Supplier Part Number 1: 478-5052-1-ND; ComponentLink1URL: http://www.avx.com/docs/Catalogs/cx7r.pdf; ComponentLink1Description: http://www.avx.com/docs/Catalogs/cx7r.pdf; Supplier 2: Digi-Key; Supplier Part Number 2: 445-1314-1-ND; ComponentLink2URL: http://product.tdk.com/capacitor/mlcc/en/documents/mlcc_commercial_general_en.pdf; ComponentLink2Description: http://product.tdk.com/capacitor/mlcc/en/documents/mlcc_commercial_general_en.pdf
C14 C16 C19 C21 C25 C28 C30 C32 C38 C39 C44-C46 C48 C51 C52 C54 C58 C61 C64 C67 C68 C71 C73 C75 = CAPT_10u_0805_10V: Capacitor SMD Tantalum 10uF 20% 10V 0805; Manufacturer 1: AVX Corporation; Manufacturer Part Number 1: TAJP106M010RNJ; Package / Case: 0805 (2012 metric); Tolerance: ±20%; Material: Tantalum; Supplier 1: Digi-Key; Supplier Part Number 1: 478-3281-1-ND; Value: 10µ
C22 C26 C40 C56 C59 C62 = CAPC_47p_0603: Capacitor SMD Cer 47pF 0603; Ratings: 50V; NP0; Operating Temperature: -55°C ~ 125°C; Package / Case: 0603 (1608 Metric); Size / Dimension: 0.063" L x 0.031" W (1.60mm x 0.80mm); Thickness (Max): 0.037" (0.95mm); ComponentLink1URL: http://www.avx.com/docs/Catalogs/ccog.pdf; ComponentLink1Description: http://www.avx.com/docs/Catalogs/ccog.pdf; ComponentLink2URL: http://www.tdk.com/pdf/tight_tol_B11.pdf; ComponentLink2Description: http://www.tdk.com/pdf/tight_tol_B11.pdf; ComponentLink3URL: http://www.kemet.com/datasheets&C0603C221F5GACTU; ComponentLink3Description: http://www.kemet.com/datasheets&C0603C221F5GACTU; Value: 47p
C69 C72 = ML03V10R1AAT2A: No Description Available; Mfr_Name: KYOCERA AVX; Type: DEV; Copyright: Copyright (C) 2022 Ultra Librarian. All rights reserved.; Manufacturer_Part_Number: ML03V10R1AAT2A; RefDes: RefDes
J1-J3 J5 J6 = FCR7350R: No Description Available; Mfr_Name: Cliff; Copyright: Copyright (C) 2022 Ultra Librarian. All rights reserved.; Manufacturer_Part_Number: FCR7350R; RefDes: RefDes; Type: DEV
J4 = FCR7350G: No Description Available; Mfr_Name: Cliff; Copyright: Copyright (C) 2022 Ultra Librarian. All rights reserved.; Manufacturer_Part_Number: FCR7350G; RefDes: RefDes; Type: Type
J7-J9 = 901200130: No Description Available; Mfr_Name: Molex Connector Corporation; Copyright: Copyright (C) 2022 Ultra Librarian. All rights reserved.; Manufacturer_Part_Number: 901200130; RefDes: RefDes; Type: DEV
J10 J13 = CES-130-01-T-S: No Description Available; Mfr_Name: Samtec Inc; Copyright: Copyright (C) 2022 Ultra Librarian. All rights reserved.; Manufacturer_Part_Number: CES-130-01-T-S; RefDes: RefDes; Type: DEV
J11 J12 = SLW-120-01-G-S: No Description Available; Mfr_Name: Samtec Inc; Copyright: Copyright (C) 2022 Ultra Librarian. All rights reserved.; Manufacturer_Part_Number: SLW-120-01-G-S; RefDes: RefDes; Type: DEV
J14 = T821112A1S100CEU: No Description Available; Mfr_Name: Amphenol ICC; Copyright: Copyright (C) 2022 Ultra Librarian. All rights reserved.; Manufacturer_Part_Number: T821112A1S100CEU; RefDes: RefDes; Type: DEV
J15 J16 = 22284110: No Description Available; Mfr_Name: Molex Connector Corporation; Copyright: Copyright (C) 2022 Ultra Librarian. All rights reserved.; Manufacturer_Part_Number: 22284110; RefDes: RefDes; Type: DEV
J17 = 825433-4: No Description Available; Mfr_Name: TE Connectivity; Copyright: Copyright (C) 2022 Ultra Librarian. All rights reserved.; Manufacturer_Part_Number: 825433-4; RefDes: RefDes; Type: DEV
L1 = MCSDRB7032-102MHF: 1mH 150mA inductor
LED1 = LED_SMD_Red_0603_220mcd: LED 0603 SMD Hyper Red 630nm 220mcd 20mA; Manufacturer 1: Kingbright Corp; Manufacturer Part Number 1: APT1608SURCK; Material: AlGaInP on GaAs; Ratings: 220 mcd; 630 nm; Voltage - Forward (Vf) Typ: 1.95V; Voltage - Forward (Vf) @ 10mA: 1.9V; Package / Case: 0603 (1608 metric); Supplier 1: Digi-Key; Supplier Part Number 1: 754-1123-1-ND
R1 R7-R10 = RES_10K_0603_1%: Resistor SMD chip 10k Ohm 0.1W 1% 0603; Manufacturer 1: Yageo; Manufacturer Part Number 1: RC0603FR-0710KL; Ratings: 1/10W; Package / Case: 0603 (1608 Metric); Supplier 1: Digi-Key; Supplier Part Number 1: 311-10.0KHRCT-ND
R2 = RES_866R_0603_1%_1: Resistor SMD chip 866 Ohm 0.1W 1% 0603; Ratings: 1/10W; Package / Case: 0603 (1608 Metric)
R3-R5 = RC0603FR-073K32L: No Description Available; Mfr_Name: Yageo; Copyright: Copyright (C) 2022 Ultra Librarian. All rights reserved.; Manufacturer_Part_Number: RC0603FR-073K32L; RefDes: RefDes; Type: DEV
R6 = RC0603FR-0714KL: No Description Available; Mfr_Name: Yageo; Copyright: Copyright (C) 2022 Ultra Librarian. All rights reserved.; Manufacturer_Part_Number: RC0603FR-0714KL; RefDes: RefDes; Type: DEV
R11-R16 = RES_2K21_0603_1%: Resistor SMD chip 2.21k Ohm 0.1W 1% 0603; Ratings: 1/10W; Package / Case: 0603 (1608 Metric)
R17 = RH73X2A50GNTN: No Description Available; Mfr_Name: TE Connectivity; Copyright: Copyright (C) 2022 Ultra Librarian. All rights reserved.; Manufacturer_Part_Number: RH73X2A50GNTN; RefDes: RefDes; Type: DEV
R18 = CRCW08054M12FKEA: No Description Available; Mfr_Name: Vishay; Copyright: Copyright (C) 2022 Ultra Librarian. All rights reserved.; Manufacturer_Part_Number: CRCW08054M12FKEA; RefDes: RefDes; Type: DEV
R19 = RC0603JR-07100RL: No Description Available; Mfr_Name: Yageo; Copyright: Copyright (C) 2022 Ultra Librarian. All rights reserved.; Manufacturer_Part_Number: RC0603JR-07100RL; RefDes: RefDes; Type: DEV
R20 R21 = RES_100K_0603_1%: Resistor SMD chip 100k Ohm 0.1W 1% 0603; Manufacturer 1: Vishay/Dale; Manufacturer Part Number 1: CRCW0603100KFKEA; Ratings: 1/10W; Package / Case: 0603 (2012 metric); Supplier 1: Digi-Key; Supplier Part Number 1: 541-100KHCT-ND
U1 = LP3961ES-2.5: No Description Available; Mfr_Name: Texas Instruments; Copyright: Copyright (C) 2022 Ultra Librarian. All rights reserved.; Manufacturer_Part_Number: LP3961ES-2.5; RefDes: RefDes; Type: DEV
U2-U5 = BD00C0AWHFP-CTR: No Description Available; Mfr_Name: ROHM Semiconductor; Copyright: Copyright (C) 2022 Ultra Librarian. All rights reserved.; Manufacturer_Part_Number: BD00C0AWHFP-CTR; RefDes: RefDes; Type: DEV
U6 U23 = REF5025AIDG4: No Description Available; Mfr_Name: Texas Instruments; Copyright: Copyright (C) 2021 Ultra Librarian. All rights reserved.; Manufacturer_Part_Number: REF5025AIDG4; RefDes: RefDes; Type: DEV
U7 U8 U15 = DAC7614EB: No Description Available; Mfr_Name: Texas Instruments; Copyright: Copyright (C) 2022 Ultra Librarian. All rights reserved.; Manufacturer_Part_Number: DAC7614EB; RefDes: RefDes; Type: DEV
U9 U11 U13 U16 U18 U20 U24 = TLV2771CDBVR: No Description Available; Mfr_Name: Texas Instruments; Copyright: Copyright (C) 2022 Ultra Librarian. All rights reserved.; Manufacturer_Part_Number: TLV2771CDBVR; RefDes: RefDes; Type: DEV
U10 U12 U14 U17 U19 U21 = BC817W: No Description Available; Mfr_Name: Nexperia; Copyright: Copyright (C) 2022 Ultra Librarian. All rights reserved.; Manufacturer_Part_Number: BC817W; RefDes: RefDes; Type: DEV
U22 = ADS8344E: No Description Available; Mfr_Name: Texas Instruments; Copyright: Copyright (C) 2022 Ultra Librarian. All rights reserved.; Manufacturer_Part_Number: ADS8344E; RefDes: RefDes; Type: DEV
U25 = OPA380AIDGKT: No Description Available; Mfr_Name: Texas Instruments; Copyright: Copyright (C) 2022 Ultra Librarian. All rights reserved.; Manufacturer_Part_Number: OPA380AIDGKT; RefDes: RefDes; Type: DEV